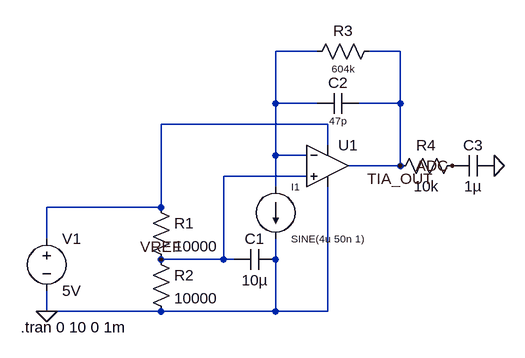
[diagram p0: schematic BPM_LTspice.asc]
BPM_LTspice.asc, the LTspice schematic file:
Version 4.1
SHEET 1 880 680
WIRE 496 -192 432 -192
WIRE 624 -192 576 -192
WIRE 432 -112 432 -192
WIRE 496 -112 432 -112
WIRE 624 -112 624 -192
WIRE 624 -112 560 -112
WIRE 512 -80 256 -80
WIRE 512 -48 512 -80
WIRE 432 -32 432 -112
WIRE 480 -32 432 -32
WIRE 624 -16 624 -112
WIRE 624 -16 544 -16
WIRE 480 0 352 0
WIRE 432 16 432 -32
WIRE 256 48 256 -80
WIRE 256 48 80 48
WIRE 80 96 80 48
WIRE 352 128 352 0
WIRE 352 128 256 128
WIRE 368 128 352 128
WIRE 432 128 432 96
WIRE 80 208 80 176
WIRE 256 208 80 208
WIRE 432 208 432 128
WIRE 432 208 256 208
WIRE 512 208 512 16
WIRE 512 208 432 208
FLAG 80 208 0
FLAG 768 -16 0
FLAG 256 128 VREF
FLAG 624 -16 TIA_OUT
FLAG 704 -16 ADC
SYMBOL voltage 80 80 R0
WINDOW 123 0 0 Left 0
WINDOW 39 0 0 Left 0
SYMATTR InstName V1
SYMATTR Value 5V
SYMBOL res 240 32 R0
SYMATTR InstName R1
SYMATTR Value 10000
SYMBOL res 240 112 R0
SYMATTR InstName R2
SYMATTR Value 10000
SYMBOL cap 432 112 R90
WINDOW 0 0 32 VBottom 2
WINDOW 3 32 32 VTop 2
SYMATTR InstName C1
SYMATTR Value 10µ
SYMBOL OpAmps\\UniversalOpAmp2 512 -16 R0
SYMATTR InstName U1
SYMBOL cap 496 -96 R270
WINDOW 0 32 32 VTop 2
WINDOW 3 0 32 VBottom 1
SYMATTR InstName C2
SYMATTR Value 47p
SYMBOL res 592 -208 R90
WINDOW 0 0 56 VBottom 2
WINDOW 3 32 56 VTop 1
SYMATTR InstName R3
SYMATTR Value 604k
SYMBOL current 432 16 R0
WINDOW 0 24 0 Left 1
WINDOW 3 24 80 Left 1
WINDOW 123 0 0 Left 0
WINDOW 39 0 0 Left 0
SYMATTR InstName I1
SYMATTR Value SINE(4u 50n 1)
SYMBOL res 720 -32 R90
WINDOW 0 0 56 VBottom 2
WINDOW 3 32 56 VTop 2
SYMATTR InstName R4
SYMATTR Value 10k
SYMBOL cap 768 -32 R90
WINDOW 0 0 32 VBottom 2
WINDOW 3 32 32 VTop 2
SYMATTR InstName C3
SYMATTR Value 1µ
TEXT 40 232 Left 2 !.tran 0 10 0 1m

The netlist it stands for:
* BPM_LTspice.asc
V1 N002 0 5V
R1 N002 VREF 10000
R2 VREF 0 10000
C1 0 VREF 10µ
X§U1 VREF N001 N002 0 TIA_OUT level2 Avol=1Meg GBW=10Meg Slew=10Meg Ilimit=25m Rail=0 Vos=0 En=0 Enk=0 In=0 Ink=0 Rin=500Meg  ; pins In+ In- V+ V- OUT
C2 N001 TIA_OUT 47p
R3 TIA_OUT N001 604k
I1 N001 0 SINE(4u 50n 1)
R4 ADC TIA_OUT 10k
C3 0 ADC 1µ
.tran 0 10 0 1m
.lib UniversalOpAmp2.lib
.backanno
.end